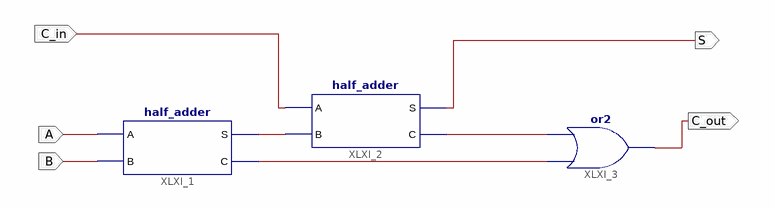
[diagram p0: schematic sheet 1]
// Xilinx ISE schematic full_adder.sch (artix7) as structural Verilog: 3 symbols, 5 ports
module full_adder (
  input  C_in,
  input  A,
  input  B,
  output S,
  output C_out
);

  wire XLXN_1, XLXN_2, XLXN_3;

  half_adder XLXI_1 (.A(A), .B(B), .S(XLXN_2), .C(XLXN_1));
  half_adder XLXI_2 (.A(C_in), .B(XLXN_2), .S(S), .C(XLXN_3));
  or XLXI_3 (C_out, XLXN_1, XLXN_3);
endmodule
